# Altium schematic sheet partial_vna.SchDoc
size A4
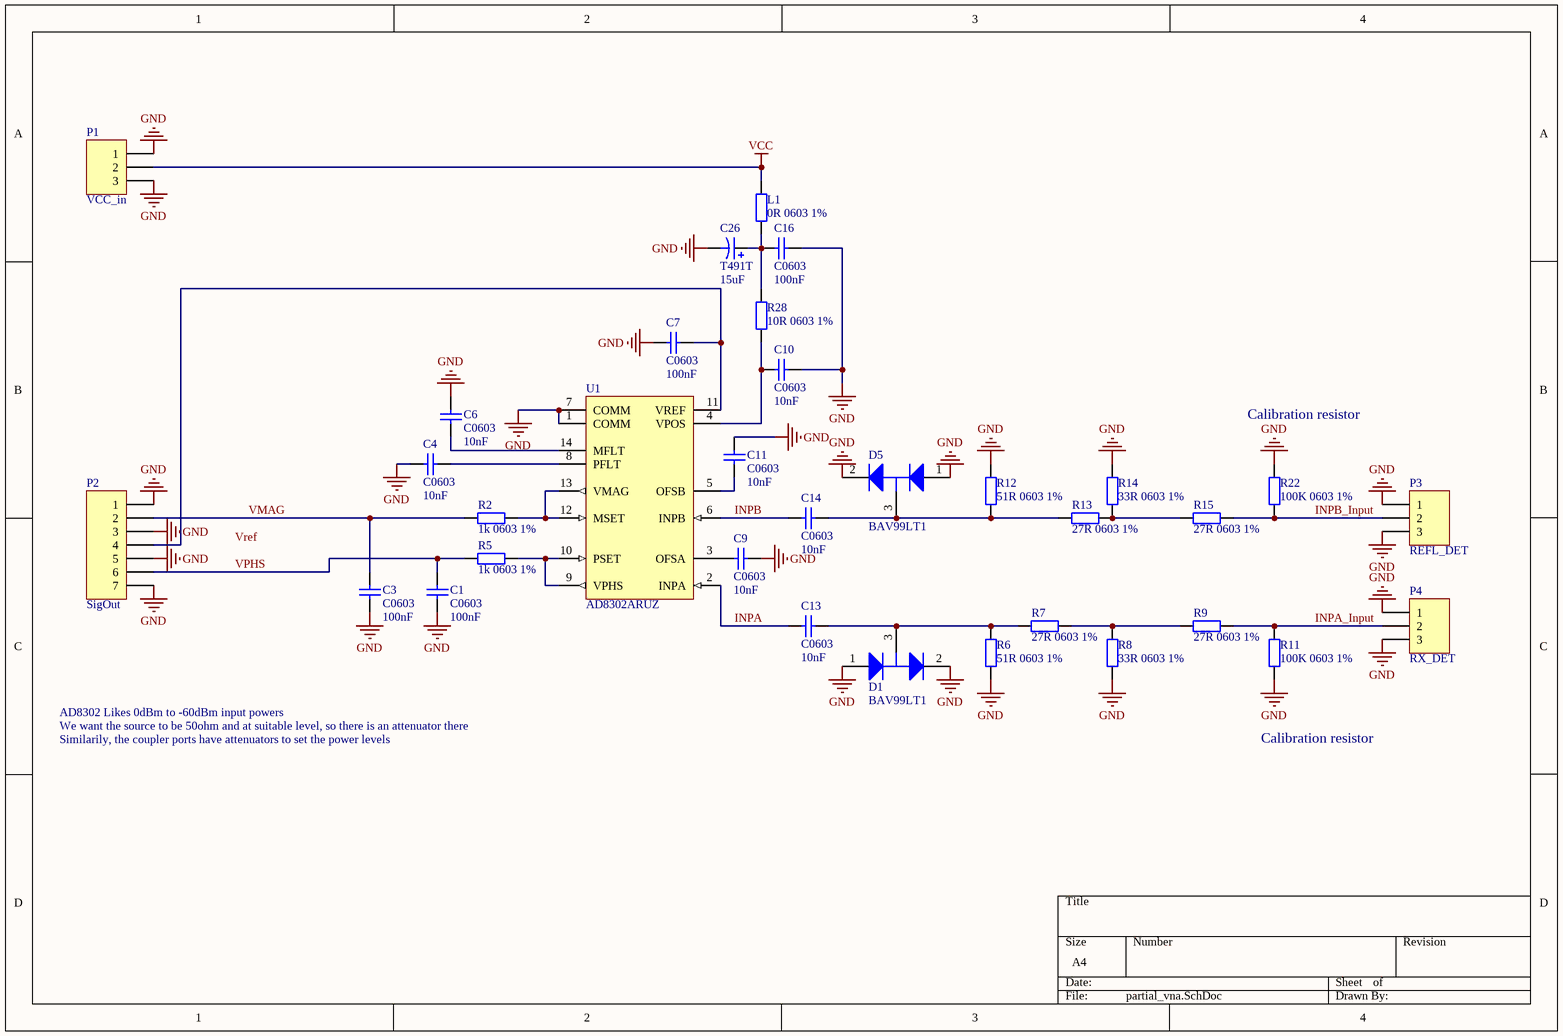
[diagram p0: partial_vna.SchDoc]

## Parts
C1  C0603  value 100nF  [0603]
C3  C0603  value 100nF  [0603]
C4  C0603  value 10nF  [0603]
C6  C0603  value 10nF  [0603]
C7  C0603  value 100nF  [0603]
C9  C0603  value 10nF  [0603]
C10  C0603  value 10nF  [0603]
C11  C0603  value 10nF  [0603]
C13  C0603  value 10nF  [0603]
C14  C0603  value 10nF  [0603]
C16  C0603  value 100nF  [0603]
C26  T491T  value 15uF  [T]
D1  BAV99LT1  [ONSC-SOT-23-3-318-08_V]
D5  BAV99LT1  [ONSC-SOT-23-3-318-08_V]
L1  0R 0603 1%  [R0603]
P1  VCC_in  [HDR1X3]
P2  SigOut  [HDR1X7]
P3  REFL_DET  [HDR1X3]
P4  RX_DET  [HDR1X3]
R2  1k 0603 1%  [R0603]
R5  1k 0603 1%  [R0603]
R6  51R 0603 1%  [R0603]
R7  27R 0603 1%  [R0603]
R8  33R 0603 1%  [R0603]
R9  27R 0603 1%  [R0603]
R11  100K 0603 1%  [R0603]
R12  51R 0603 1%  [R0603]
R13  27R 0603 1%  [R0603]
R14  33R 0603 1%  [R0603]
R15  27R 0603 1%  [R0603]
R22  100K 0603 1%  [R0603]
R28  10R 0603 1%  [R0603]
U1  AD8302ARUZ  [ADI-RU-14_L]

## Nets
GND: C1.1 C3.1 C4.2 C6.2 C7.2 C9.1 C10.2 C11.1 C16.2 C26.2 D1.1(A) D1.2(K) D5.1(A) D5.2(K) P1.1 P1.3 P2.1 P2.3 P2.5 P2.7 P3.1 P3.3 P4.1 P4.3 R6.1 R8.1 R11.1 R12.2 R14.2 R22.2 U1.1(COMM) U1.7(COMM)
VCC: L1.2 P1.2
INPA: C13.2 U1.2(INPA)
INPA_Input: P4.2 R9.2 R11.2
INPB: C14.2 U1.6(INPB)
INPB_Input: P3.2 R15.2 R22.1
VMAG: C3.2 P2.2 R2.1
VPHS: C1.2 P2.6 R5.1
NetC4_1: C4.1 U1.8(PFLT)
NetC6_1: C6.1 U1.14(MFLT)
NetC7_1: C7.1 P2.4 U1.11(VREF)
NetC9_2: C9.2 U1.3(OFSA)
NetC10_1: C10.1 R28.1 U1.4(VPOS)
NetC11_2: C11.2 U1.5(OFSB)
NetC13_1: C13.1 D1.3(K/A) R6.2 R7.1
NetC14_1: C14.1 D5.3(K/A) R12.1 R13.1
NetC16_1: C16.1 C26.1 L1.1 R28.2
NetR2_2: R2.2 U1.12(MSET) U1.13(VMAG)
NetR5_2: R5.2 U1.9(VPHS) U1.10(PSET)
NetR7_2: R7.2 R8.2 R9.1
NetR13_2: R13.2 R14.1 R15.1

## Notes on the sheet
- Calibration resistor
- AD8302 Likes 0dBm to -60dBm input powers
- We want the source to be 50ohm and at suitable level, so there is an attenuator there
- Similarily, the coupler ports have attenuators to set the power levels
- Labels drawn without touching a wire or pin: Vref

## Library data of the parts
C1 C3 C4 C6 C7 C9-C11 C13 C14 C16 = C0603: Ceramic Chip Capacitor - Standard; Note: Footprint corresponds to dimensions for bulk cassette packaging. This case size has tightened tolerances.; Published: 17-Jul-2002; LatestRevisionDate: 19-Mar-2004; LatestRevisionNote: Silkscreen size reduced.; DatasheetDocument: Mar-2001; PackageDocument: Mar-2001; PackageReference: 0603; Publisher: Altium Limited; Code_JEITA: 0603; Code_IPC: 1608 [0603]; ComponentLink1Description: Manufacturer Link; ComponentLink1URL: http://www.kemet.com/; ComponentLink2Description: Datasheet; ComponentLink2URL: http://www.kemet.com/kemet/web/homepage/kechome.nsf/vapubfilesname/F3102TA.pdf/$file/F3102TA.pdf
C26 = T491T: Solid Tantalum Chip Capacitor, Low Profile T491 Series - Industrial Grade; Published: 17-Jul-2002; LatestRevisionDate: 19-Mar-2004; LatestRevisionNote: Silkscreen dimensions re-sized.; DatasheetDocument: Mar-2001; PackageDocument: Mar-2001; PackageReference: T; Publisher: Altium Limited; Code_JEITA: 3528-12; ComponentLink1Description: Manufacturer Link; ComponentLink1URL: http://www.kemet.com/; ComponentLink2Description: Datasheet; ComponentLink2URL: http://www.kemet.com/kemet/web/homepage/kechome.nsf/vapubfilesname/F3102TA.pdf/$file/F3102TA.pdf
D1 D5 = BAV99LT1: Dual Series Switching Diodes, 3-Pin SOT-23, Tape and Reel; Manufacturer: On Semiconductor; IF Max (A): 0.215; trr Max (ns): 6; DatasheetVersion: Rev. 9; PackageVersion: Rev. AP, 11/2009; PackageReference: SOT-23-3-318-08; PackageDescription: 3-Pin Small Outline Transistor, Body 2.92 x 1.3 mm, Pitch 0.95 mm; Supplier 1: Digi-Key; Supplier Part Number 1: BAV99LT1OSCT-ND; Configuration: Dual Series; Packing: Tape and Reel; RoHS: FALSE; Mounting Technology: Surface Mount; PartNumber: BAV99LT1; ComponentLink1Description: Manufacturer URL; ComponentLink1URL: http://www.onsemi.com/; ComponentLink2Description: Datasheet; ComponentLink2URL: http://www.onsemi.cn/pub_link/Collateral/BAV99LT1-D.PDF; ComponentLink3Description: Package Specification; ComponentLink3URL: http://www.onsemi.cn/pub_link/Collateral/318-08.PDF
L1 = 0R 0603: Value: 0R; Case: 0603; Tolerance: 1%; Publisher: iv
P1 P3 P4 = Header 3: Header, 3-Pin; LatestRevisionDate: 17-Jul-2002; LatestRevisionNote: Re-released for DXP Platform.; Publisher: Altium Limited
P2 = Header 7: Header, 7-Pin; LatestRevisionDate: 17-Jul-2002; LatestRevisionNote: Re-released for DXP Platform.; Publisher: Altium Limited
R2 R5 = RES 1k 0603: Value: 1k; Case: 0603; Tolerance: 1%; Publisher: iv
R6 R12 = RES 51R 0603: Value: 51R; Case: 0603; Tolerance: 1%; Publisher: iv
R7 R9 R13 R15 = RES 27R 0603: Value: 27R; Case: 0603; Tolerance: 1%; Publisher: iv
R8 R14 = RES 33R 0603: Value: 33R; Case: 0603; Tolerance: 1%; Publisher: iv
R11 R22 = RES 100K 0603: Value: 100K; Case: 0603; Tolerance: 1%; Publisher: iv
R28 = RES 10R 0603: Value: 10R; Case: 0603; Tolerance: 1%; Publisher: iv
U1 = CMP-0284-00076-1: LF-2.7 GHz RF/IF Gain and Phase Detector, 60ns Response Time, RU-14, Pb-Free, 96 Tube; Voltage Supply (V): 2.7 to 5.5; RF Frequency (MHz): 2700; Dynamic Range (dB): 60dB; Supply Current: 19mA; Temp Stability (dB): 1dB; Product Description: Dual-Channel Gain and Phase Outputs; ComponentLink1URL: www.analog.com; Response Time (ns typ): 60ns; ComponentLink1Description: Manufacturer URL; Code_JEDEC: MO-153AB-1; ComponentLink3URL: http://www.analog.com/static/imported-files/packages/36057385283879153717235186773RU14.pdf; PackageReference: RU-14; PackageVersion: Aug-2002; DatasheetVersion: Rev. A; ComponentLink2URL: http://www.analog.com/static/imported-files/data_sheets/AD8302.pdf; ComponentLink3Description: Package Specification; PackageDescription: 14-Lead Thin Shrink Small Outline Package [TSSOP]; ComponentLink2Description: Datasheet